# EAGLE schematic D21_v39 (EAGLE 7.3.0)

## Sheet 1 of 4
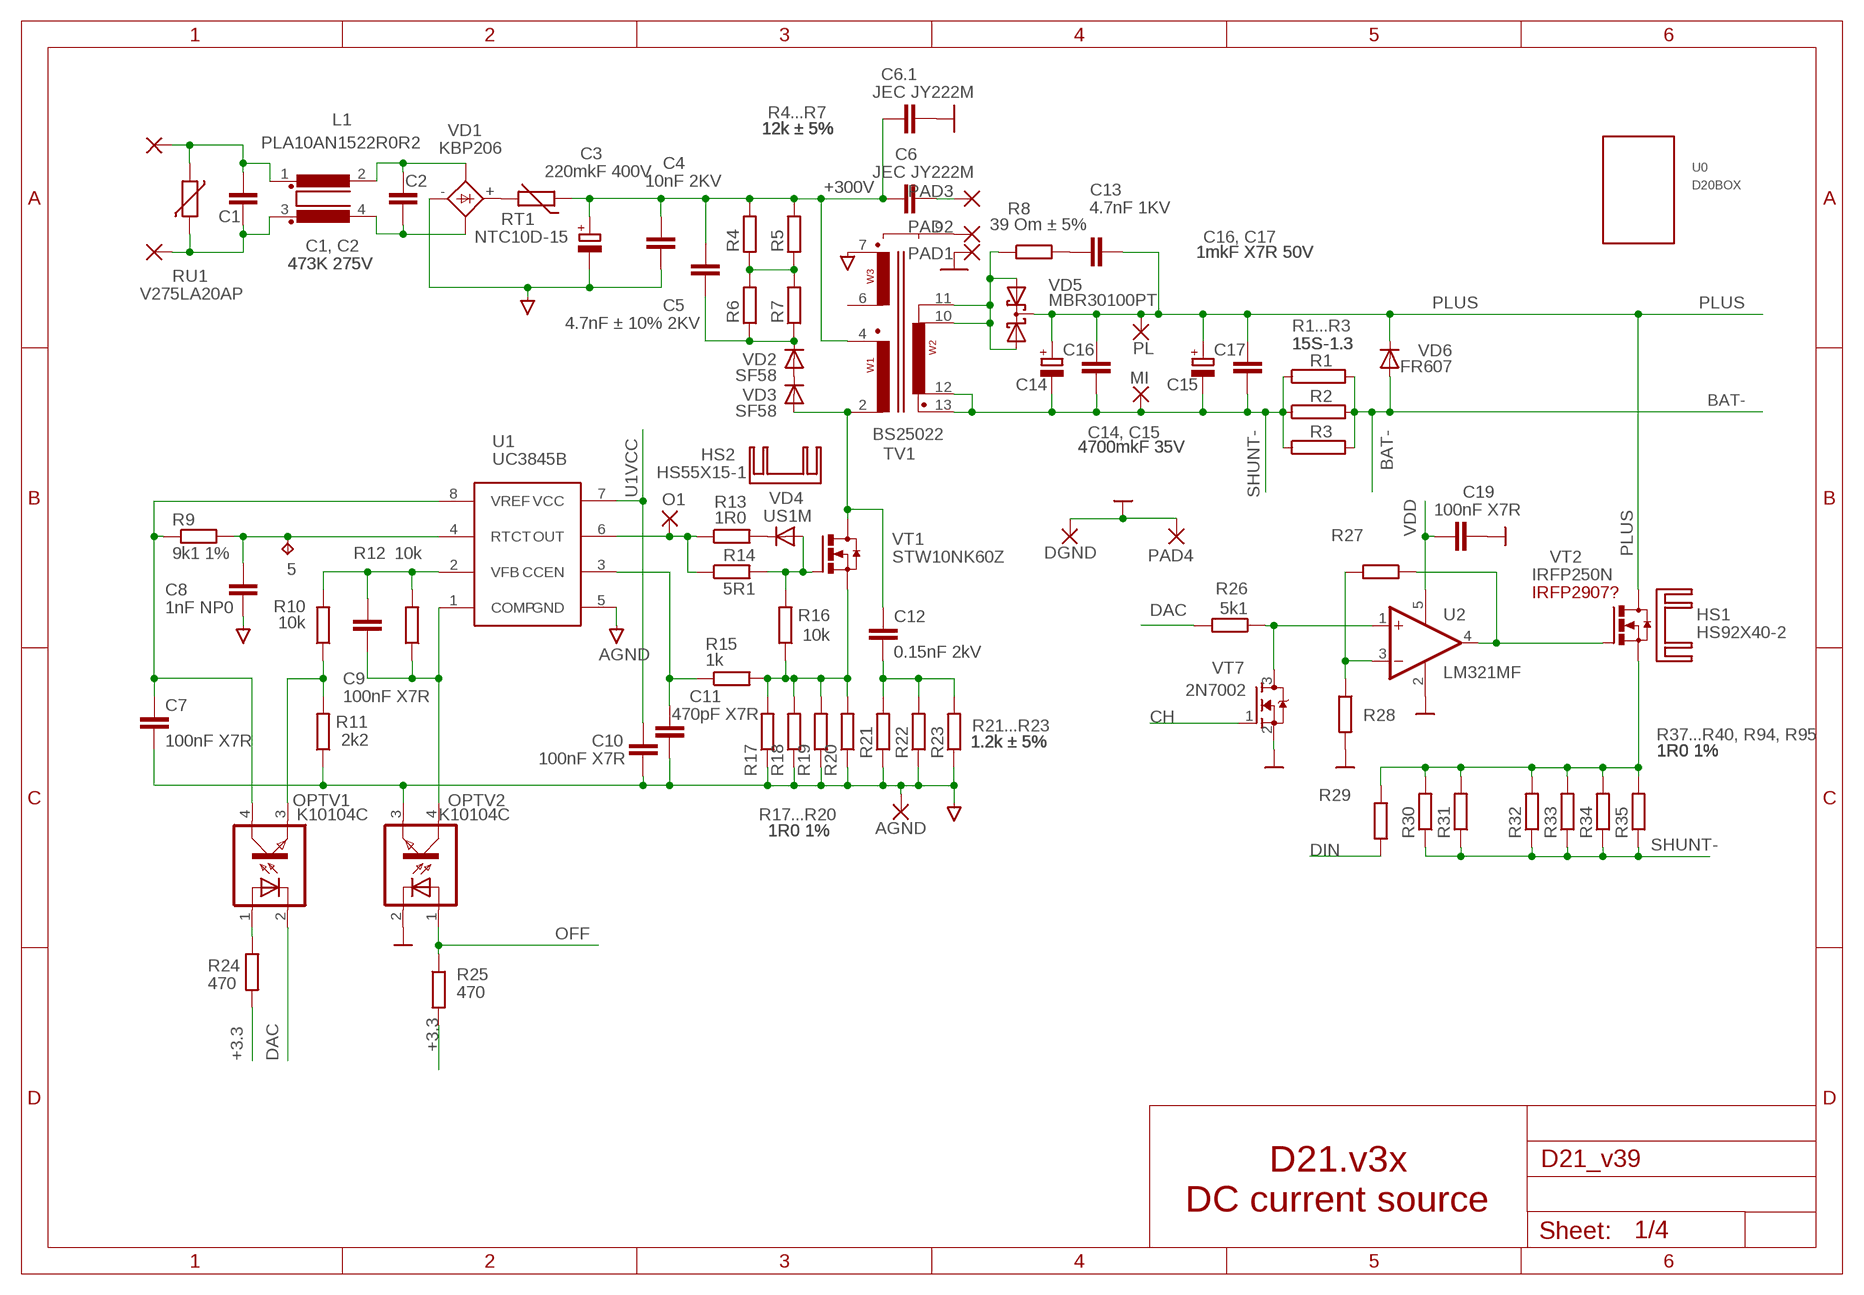
[diagram p0: schematic, sheet 1]

### Parts
5  TPB1,27  [B1,27]
AGND  WIREPAD4,16O1,6  [4,16O1,6]
C1  473K 275V  C-EU150-054X183  [C150-054X183]
C2  473K 275V  C-EU150-054X183  [C150-054X183]
C3  220mkF 400V  CPOL-EUE10-25  [EB25D]
C4  10nF 2KV  C-EU102-043X133  [C102-043X133]
C5  4.7nF ± 10% 2KV  C-EU102-064X133  [C102-064X133]
C6  JEC JY222M  C-EU102-064X133  [C102-064X133]
C6.1  JEC JY222M  C-EU102-064X133  [C102-064X133]
C7  100nF X7R  C-EUC0603  [C0603]
C8  1nF NP0  C-EUC0603  [C0603]
C9  100nF X7R  C-EUC0603  [C0603]
C10  100nF X7R  C-EUC0805  [C0805]
C11  470pF X7R  C-EUC0603  [C0603]
C12  0.15nF 2kV  C-EU075-032X103  [C075-032X103]
C13  4.7nF 1KV  C-EU102-064X133  [C102-064X133]
C14  4700mkF 35V  CPOL-EUE7.5-18  [E7,5-18]
C15  4700mkF 35V  CPOL-EUE7.5-18  [E7,5-18]
C16  1mkF X7R 50V  C-EUC0805  [C0805]
C17  1mkF X7R 50V  C-EUC0805  [C0805]
C19  100nF X7R  C-EUC0603  [C0603]
DGND  WIREPAD4,16O1,6  [4,16O1,6]
HS1  HS92X40-2  [YS92X40]
HS2  HS55X15-1  [HS55X15]
L1  PLA10AN1522R0R2  DK_Q921  [DK30]
MI  WIREPAD4,16O1,6  [4,16O1,6]
O1  WIREPAD1,6/0,8  [1,6/0,8]
OPTV1  K10104C  SFH618A-3X007  [SMD4-7]
OPTV2  K10104C  SFH618A-3X007  [SMD4-7]
PAD1  SMD2  [SMD1,27-2,54]
PAD2  SMD2  [SMD1,27-2,54]
PAD3  SMD2  [SMD1,27-2,54]
PAD4  WIREPAD4,16O1,6  [4,16O1,6]
PL  WIREPAD4,16O1,6  [4,16O1,6]
R1  15S-1.3  [15S-1.3]
R2  15S-1.3  [15S-1.3]
R3  15S-1.3  [15S-1.3]
R4  12k ± 5%  R-0515/20  [0515/20]
R5  12k ± 5%  R-0515/20  [0515/20]
R6  12k ± 5%  R-0515/20  [0515/20]
R7  12k ± 5%  R-0515/20  [0515/20]
R8  39 Om ± 5%  R-0515/20  [0515/20]
R9  9k1 1%  R-EU_R0603  [R0603]
R10  10k  R-EU_R0603  [R0603]
R11  2k2  R-EU_R0603  [R0603]
R12  10k  R-EU_R0603  [R0603]
R13  1R0  R-EU_R0805  [R0805]
R14  5R1  R-EU_R0805  [R0805]
R15  1k  R-EU_R0603  [R0603]
R16  10k  R-EU_R0603  [R0603]
R17  1R0 1%  R-EU_R2512  [R2512]
R18  1R0 1%  R-EU_R2512  [R2512]
R19  1R0 1%  R-EU_R2512  [R2512]
R20  1R0 1%  R-EU_R2512  [R2512]
R21  1.2k ± 5%  R-0515/20  [0515/20]
R22  1.2k ± 5%  R-0515/20  [0515/20]
R23  1.2k ± 5%  R-0515/20  [0515/20]
R24  470  R-EU_R0603  [R0603]
R25  470  R-EU_R0603  [R0603]
R26  5k1  R-EU_R0603  [R0603]
R27  R-EU_R0603  [R0603]
R28  R-EU_R0603  [R0603]
R29  R-EU_R0603  [R0603]
R30  1R0 1%  R-EU_R2512  [R2512]
R31  1R0 1%  R-EU_R2512  [R2512]
R32  1R0 1%  R-EU_R2512  [R2512]
R33  1R0 1%  R-EU_R2512  [R2512]
R34  1R0 1%  R-EU_R2512  [R2512]
R35  1R0 1%  R-EU_R2512  [R2512]
RT1  NTC10D-15  THERMISTOR  [NTC15]
RU1  V275LA20AP  VARISTOR-H  [S10K11-H]
TV1  BS25022  [BS25022]
U0  D20BOX  [D20BOX]
U1  UC3845B  [SO08]
U2  LM321MF  [SOT23-5]
VD1  KBP206  2KBP  [2KBP]
VD2  SF58  1N5624  [DO201-15]
VD3  SF58  1N5624  [DO201-15]
VD4  US1M  DIODESMA  [SMADIODE]
VD5  MBR30100PT  [TO-247AD-V]
VD6  FR607  DIODE-P6-15  [P6-15]
VT1  STW10NK60Z  [TO-247AD-V]
VT2  IRFP250N  IRFP25X  [TO-247AD-V]
VT7  2N7002  MOSFET-NREFLOW  [SOT23-R]
X1  220VAC  [220VAC]

### Nets
10-11: R8.1 TV1.10 TV1.11 VD5.G(A1) VD5.S(A2)
+3.3: R24.2 R25.2 ; also sheet 2,3,4
+300V: C3.+ C4.1 C5.1 C6.1 C6.1.1 R4.2 R5.2 RT1.1 TV1.4 ; also sheet 2
AGND: AGND.1(P) C3.- C4.2 C7.2 C8.2 C10.2 C11.2 OPTV2.3(EMIT) R11.1 R17.1 R18.1 R19.1 R20.1 R21.1 R22.1 R23.1 TV1.7 U1.5(GND) VD1.- ; also sheet 2
BAT-: R1.2 R2.2 R3.2 VD6.A ; also sheet 3,4
CH: VT7.1(G) ; also sheet 4
DAC: OPTV1.2(C) R26.2 ; also sheet 4
DIN: R29.2 ; also sheet 4
DIN1: R29.1 R30.2 R31.2 R32.2 R33.2 R34.2 R35.2 VT2.S
GND: C6.1.2 C19.1 DGND.1(P) OPTV2.2(C) PAD1.1(P) PAD4.1(P) R28.2 U2.2(V-) VT7.2(S) ; supply symbol labelled  ; also sheet 2,3,4
HS2: C5.2 R6.1 R7.1 VD2.C
N$3: R4.1 R5.1 R6.2 R7.2
N$4: VD2.A VD3.C
N$5: C12.1 TV1.2 VD3.A VT1.D
N$6: C12.2 R21.2 R22.2 R23.2
N$7: C1.2 L1.3 RU1.2 X1.P$2
N$8: RT1.2 VD1.+
N$10: R14.2 R16.2 VD4.A VT1.G
N$11: PAD2.1(P) TV1.9
N$12: R15.2 R16.1 R17.2 R18.2 R19.2 R20.2 VT1.S
N$13: C2.1 L1.2 VD1.AC1
N$14: C1.1 L1.1 RU1.1 X1.P$1
N$15: C2.2 L1.4 VD1.AC2
N$17: O1.1(P) R13.1 R14.1 U1.6(OUT)
N$18: R13.2 VD4.C
N$25: OPTV1.1(A) R24.1
N$27: C11.1 R15.1 U1.3(CCEN)
N$30: C9.2 OPTV2.4(COL) R12.1 U1.1(COMP)
N$31: C9.1 R10.2 R12.2 U1.2(VFB)
N$32: OPTV1.3(EMIT) R10.1 R11.2
N$33: C7.1 OPTV1.4(COL) R9.1 U1.8(VREF)
N$34: 5.TP C8.1 R9.2 U1.4(RTCT)
N$35: R27.1 U2.4(OUT) VT2.G
N$38: R27.2 R28.1 U2.3(-IN)
N$41: R26.1 U2.1(+IN) VT7.3(D)
N$42: C6.2 PAD3.1(P)
N$49: C13.1 R8.2
OFF: OPTV2.1(A) R25.1 ; also sheet 4
PLUS: C13.2 C14.+ C15.+ C16.1 C17.1 PL.1(P) VD5.D(C) VD6.C VT2.D ; also sheet 3
SHUNT-: C14.- C15.- C16.2 C17.2 MI.1(P) R1.1 R2.1 R3.1 R30.1 R31.1 R32.1 R33.1 R34.1 R35.1 TV1.12 TV1.13 ; also sheet 4
U1VCC: C10.1 U1.7(VCC) ; also sheet 2
VDD: C19.2 U2.5(V+) ; also sheet 2
Unconnected: TV1.6

### Notes on the sheet
- R4...R7
- C16, C17
- C1, C2
- R1...R3
- C14, C15
- IRFP2907?
- R21...R23
- R37...R40, R94, R95
- R17...R20
- D21.v3x
  DC current source

## Sheet 2 of 4
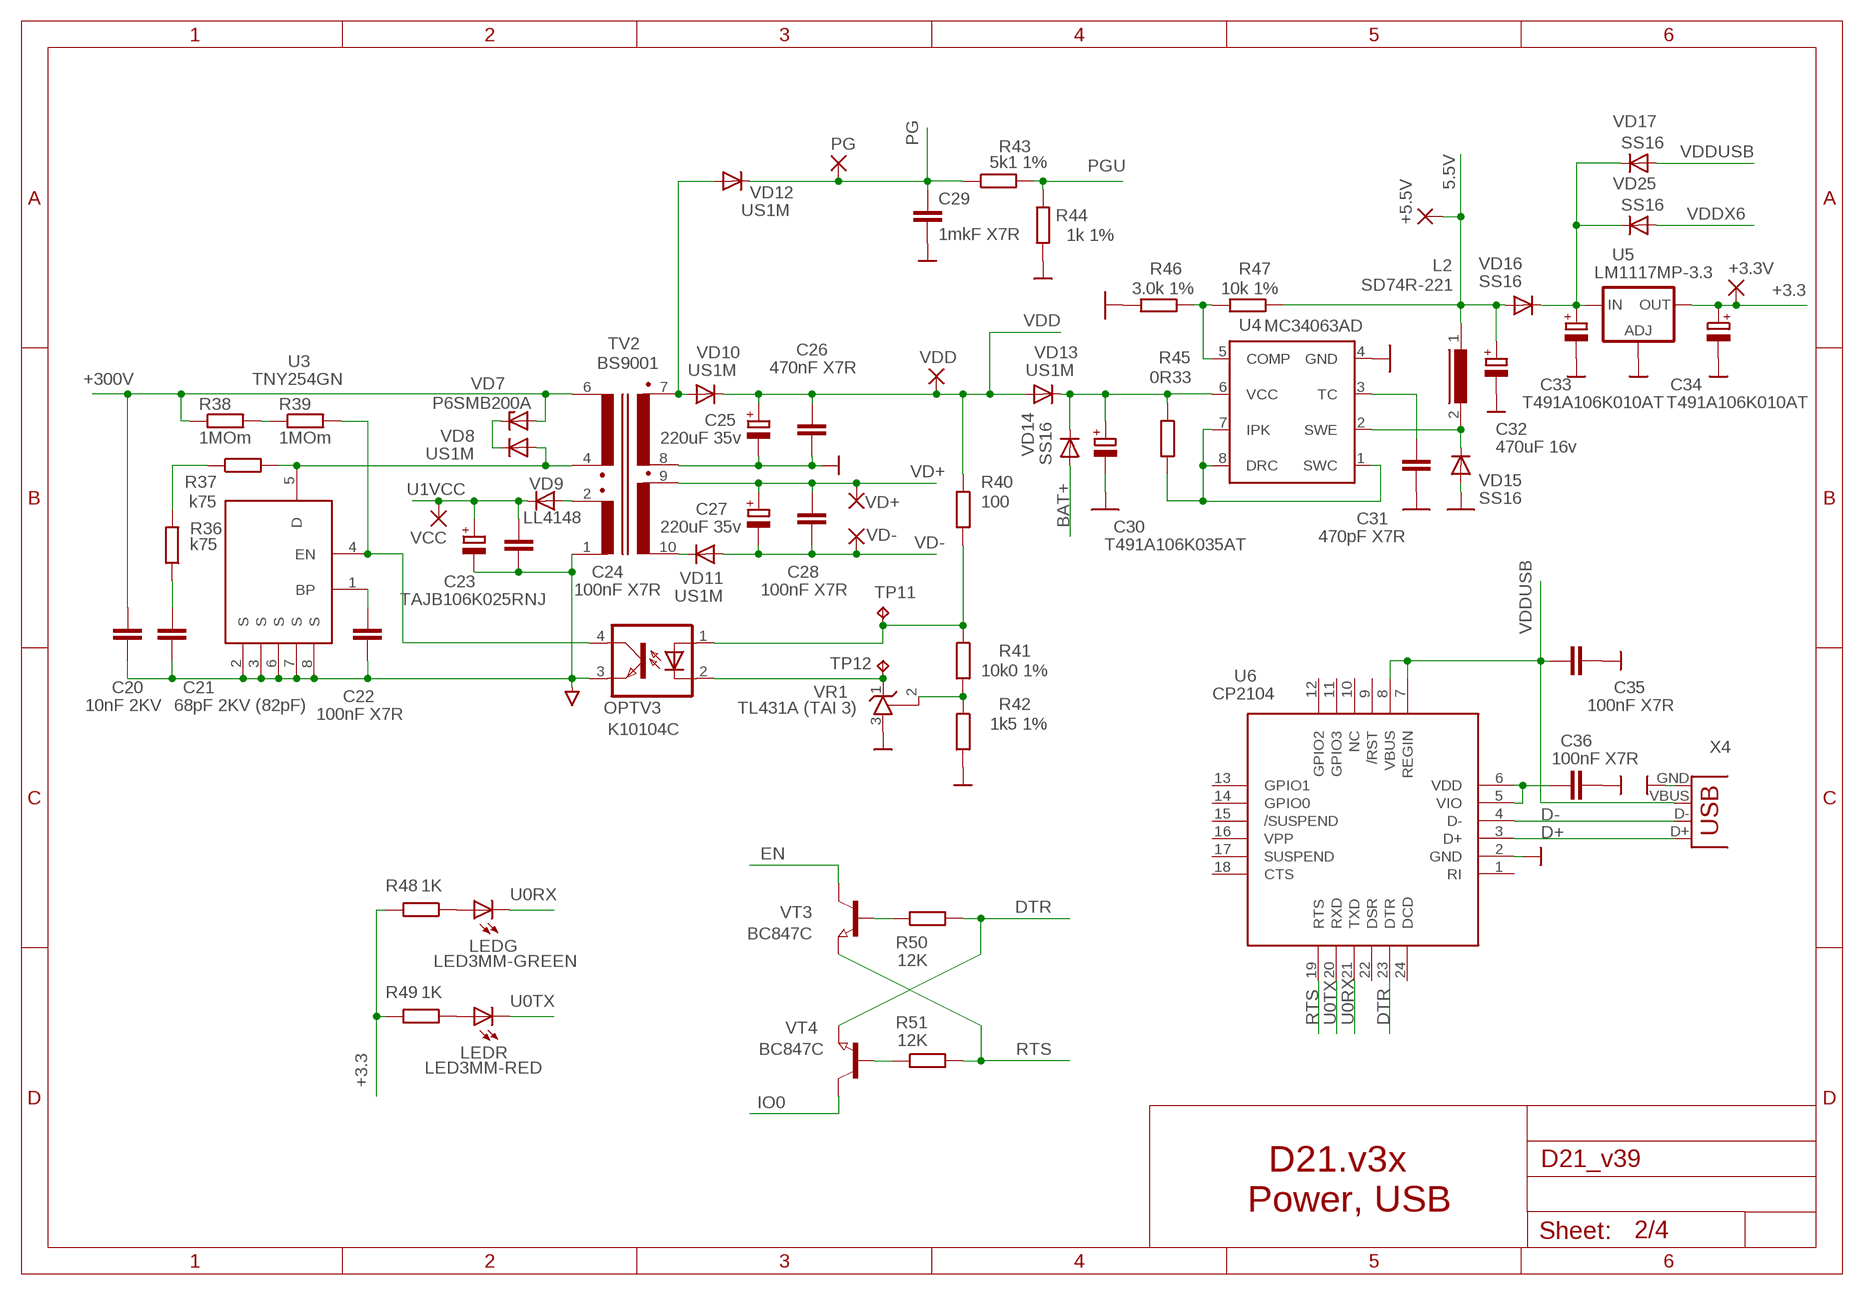
[diagram p1: schematic, sheet 2]

### Parts
+3.3V  WIREPAD1,6/0,8  [1,6/0,8]
+5.5V  WIREPAD1,6/0,8  [1,6/0,8]
C20  10nF 2KV  C-EU102-043X133  [C102-043X133]
C21  68pF 2KV (82pF)  C-EU050-024X044  [C050-024X044]
C22  100nF X7R  C-EUC0603  [C0603]
C23  TAJB106K025RNJ  CPOL-EUCT6032  [CT6032]
C24  100nF X7R  C-EUC0603  [C0603]
C25  220uF 35v  CPOL-EUE3.5-8  [E3,5-8]
C26  470nF X7R  C-EUC0805  [C0805]
C27  220uF 35v  CPOL-EUE3.5-8  [E3,5-8]
C28  100nF X7R  C-EUC0805  [C0805]
C29  1mkF X7R  C-EUC0805  [C0805]
C30  T491A106K035AT  CPOL-EUCT6032  [CT6032]
C31  470pF X7R  C-EUC0603  [C0603]
C32  470uF 16v  CPOL-EUE5-8.5  [E5-8,5]
C33  T491A106K010AT  CPOL-EUCT3216  [CT3216]
C34  T491A106K010AT  CPOL-EUCT3216  [CT3216]
C35  100nF X7R  C-EUC0603  [C0603]
C36  100nF X7R  C-EUC0603  [C0603]
L2  SD74R-221  DR74  [DR74]
LEDG  LED3MM-GREEN  LED3MM-H7MMG  [LED3MM-H7MMG]
LEDR  LED3MM-RED  LED3MM-H7MMR  [LED3MM-H7MMR]
OPTV3  K10104C  SFH618A-3X007  [SMD4-7]
PG  WIREPAD1,6/0,8  [1,6/0,8]
R36  k75  R-EU_R1206  [R1206]
R37  k75  R-EU_R1206  [R1206]
R38  1MOm  R-EU_R1206  [R1206]
R39  1MOm  R-EU_R1206  [R1206]
R40  100  R-EU_R0603  [R0603]
R41  10k0 1%  R-EU_R0603  [R0603]
R42  1k5 1%  R-EU_R0603  [R0603]
R43  5k1 1%  R-EU_R0603  [R0603]
R44  1k 1%  R-EU_R0603  [R0603]
R45  0R33  R-EU_R0603  [R0603]
R46  3.0k 1%  R-EU_R0603  [R0603]
R47  10k 1%  R-EU_R0603  [R0603]
R48  1K  R-EU_R0603  [R0603]
R49  1K  R-EU_R0603  [R0603]
R50  12K  R-EU_R0603  [R0603]
R51  12K  R-EU_R0603  [R0603]
TP11  TPB1,27  [B1,27]
TP12  TPB1,27  [B1,27]
TV2  BS9001  [BS9001]
U3  TNY254GN  [SMD-8]
U4  MC34063AD  [SO08]
U5  LM1117MP-3.3  LM1117SOT223-WAVE  [SOT223-W]
U6  CP2104  [QFN-24]
VCC  WIREPAD1,6/0,8  [1,6/0,8]
VD7  P6SMB200A  ZENER-DIODESMB  [SMB]
VD8  US1M  DIODESMA  [SMADIODE]
VD9  LL4148  DIODE-SOD80C  [SOD80C]
VD10  US1M  DIODESMA  [SMADIODE]
VD11  US1M  DIODESMA  [SMADIODE]
VD12  US1M  DIODESMA  [SMADIODE]
VD13  US1M  DIODESMA  [SMADIODE]
VD14  SS16  DIODESMA  [SMADIODE]
VD15  SS16  DIODESMA  [SMADIODE]
VD16  SS16  DIODESMA  [SMADIODE]
VD17  SS16  DIODESMA  [SMADIODE]
VD25  SS16  DIODESMA  [SMADIODE]
VD+  WIREPAD1,6/0,8  [1,6/0,8]
VD-  WIREPAD1,6/0,8  [1,6/0,8]
VDD  WIREPAD1,6/0,8  [1,6/0,8]
VR1  TL431A (TAI 3)  TL431-SOT23-3  [SOT23]
VT3  BC847C  NPN-TRANSISTOR_SOT23  [SOT23]
VT4  BC847C  NPN-TRANSISTOR_SOT23  [SOT23]
X4  USB-B  USB-B-H  [USB-B-H]

### Nets
5.5V: +5.5V.1(P) C32.+ L2.1 R47.2 VD16.A ; also sheet 3
+3.3: +3.3V.1(P) C34.+ R48.2 R49.2 U5.2(OUT) ; also sheet 1,3,4
+300V: C20.1 R38.1 TV2.6 VD7.A ; also sheet 1
AGND: C20.2 C21.2 C22.2 C23.- C24.2 OPTV3.3(EMIT) TV2.1 U3.2(S) U3.3(S) U3.6(S) U3.7(S) U3.8(S) ; also sheet 1
BAT+: VD14.A ; also sheet 3,4
D+: U6.3(D+) X4.D+
D-: U6.4(D-) X4.D-
DTR: R50.2 U6.23(DTR) VT4.2(E)
EN: VT3.3(C) ; also sheet 3
GND: C25.- C26.2 C29.2 C30.- C31.2 C32.- C33.- C34.- C35.2 C36.2 R42.2 R44.1 R46.1 TV2.8 U4.4(GND) U5.1(ADJ) U6.2(GND) VD15.A VR1.3(A) X4.GND ; supply symbol labelled  ; also sheet 1,3,4
IO0: VT4.3(C) ; also sheet 3
N$1: R36.2 R37.1
N$2: C36.1 U6.5(VIO) U6.6(VDD)
N$16: R37.2 TV2.4 U3.5(D) VD8.A
N$19: C21.1 R36.1
N$20: C22.1 U3.1(BP)
N$21: R38.2 R39.1
N$22: OPTV3.4(COL) R39.2 U3.4(EN)
N$23: OPTV3.1(A) R40.2 R41.1 TP11.TP
N$24: TV2.2 VD9.A
N$26: VD7.C VD8.C
N$45: TV2.10 VD11.C
N$46: TV2.7 VD10.A VD12.A
N$50: C30.+ R45.1 U4.6(VCC) VD13.C VD14.C
N$51: LEDR.A R49.1
N$52: LEDG.A R48.1
N$64: R45.2 U4.1(SWC) U4.7(IPK) U4.8(DRC)
N$65: L2.2 U4.2(SWE) VD15.C
N$66: C31.1 U4.3(TC)
N$67: R46.2 R47.1 U4.5(COMP)
N$69: C33.+ U5.3(IN) VD16.C VD17.C VD25.C
N$70: R41.2 R42.1 VR1.2(R)
N$71: R51.1 VT4.1(B)
N$72: R50.1 VT3.1(B)
N$73: OPTV3.2(C) TP12.TP VR1.1(C)
PG: C29.1 PG.1(P) R43.1 VD12.C ; also sheet 3
PGU: R43.2 R44.2 ; also sheet 3
RTS: R51.2 U6.19(RTS) VT3.2(E)
U0RX: LEDG.K(C) U6.21(TXD) ; also sheet 3
U0TX: LEDR.K(C) U6.20(RXD) ; also sheet 3
U1VCC: C23.+ C24.1 VCC.1(P) VD9.C ; also sheet 1
VD+: C27.+ C28.1 TV2.9 VD+.1(P) ; also sheet 3
VD-: C27.- C28.2 VD11.A VD-.1(P) ; also sheet 3
VDD: C25.+ C26.1 R40.1 VD10.C VD13.A VDD.1(P) ; also sheet 1
VDDUSB: C35.1 U6.7(REGIN) U6.8(VBUS) VD17.A X4.VBUS
VDDX6: VD25.A ; also sheet 4
Unconnected: U6.1(RI) U6.9(/RST) U6.10(NC) U6.11(GPIO3) U6.12(GPIO2) U6.13(GPIO1) U6.14(GPIO0) U6.15(/SUSPEND) U6.16(VPP) U6.17(SUSPEND) U6.18(CTS) U6.22(DSR) U6.24(DCD)

### Notes on the sheet
- D21.v3x
  Power, USB

## Sheet 3 of 4
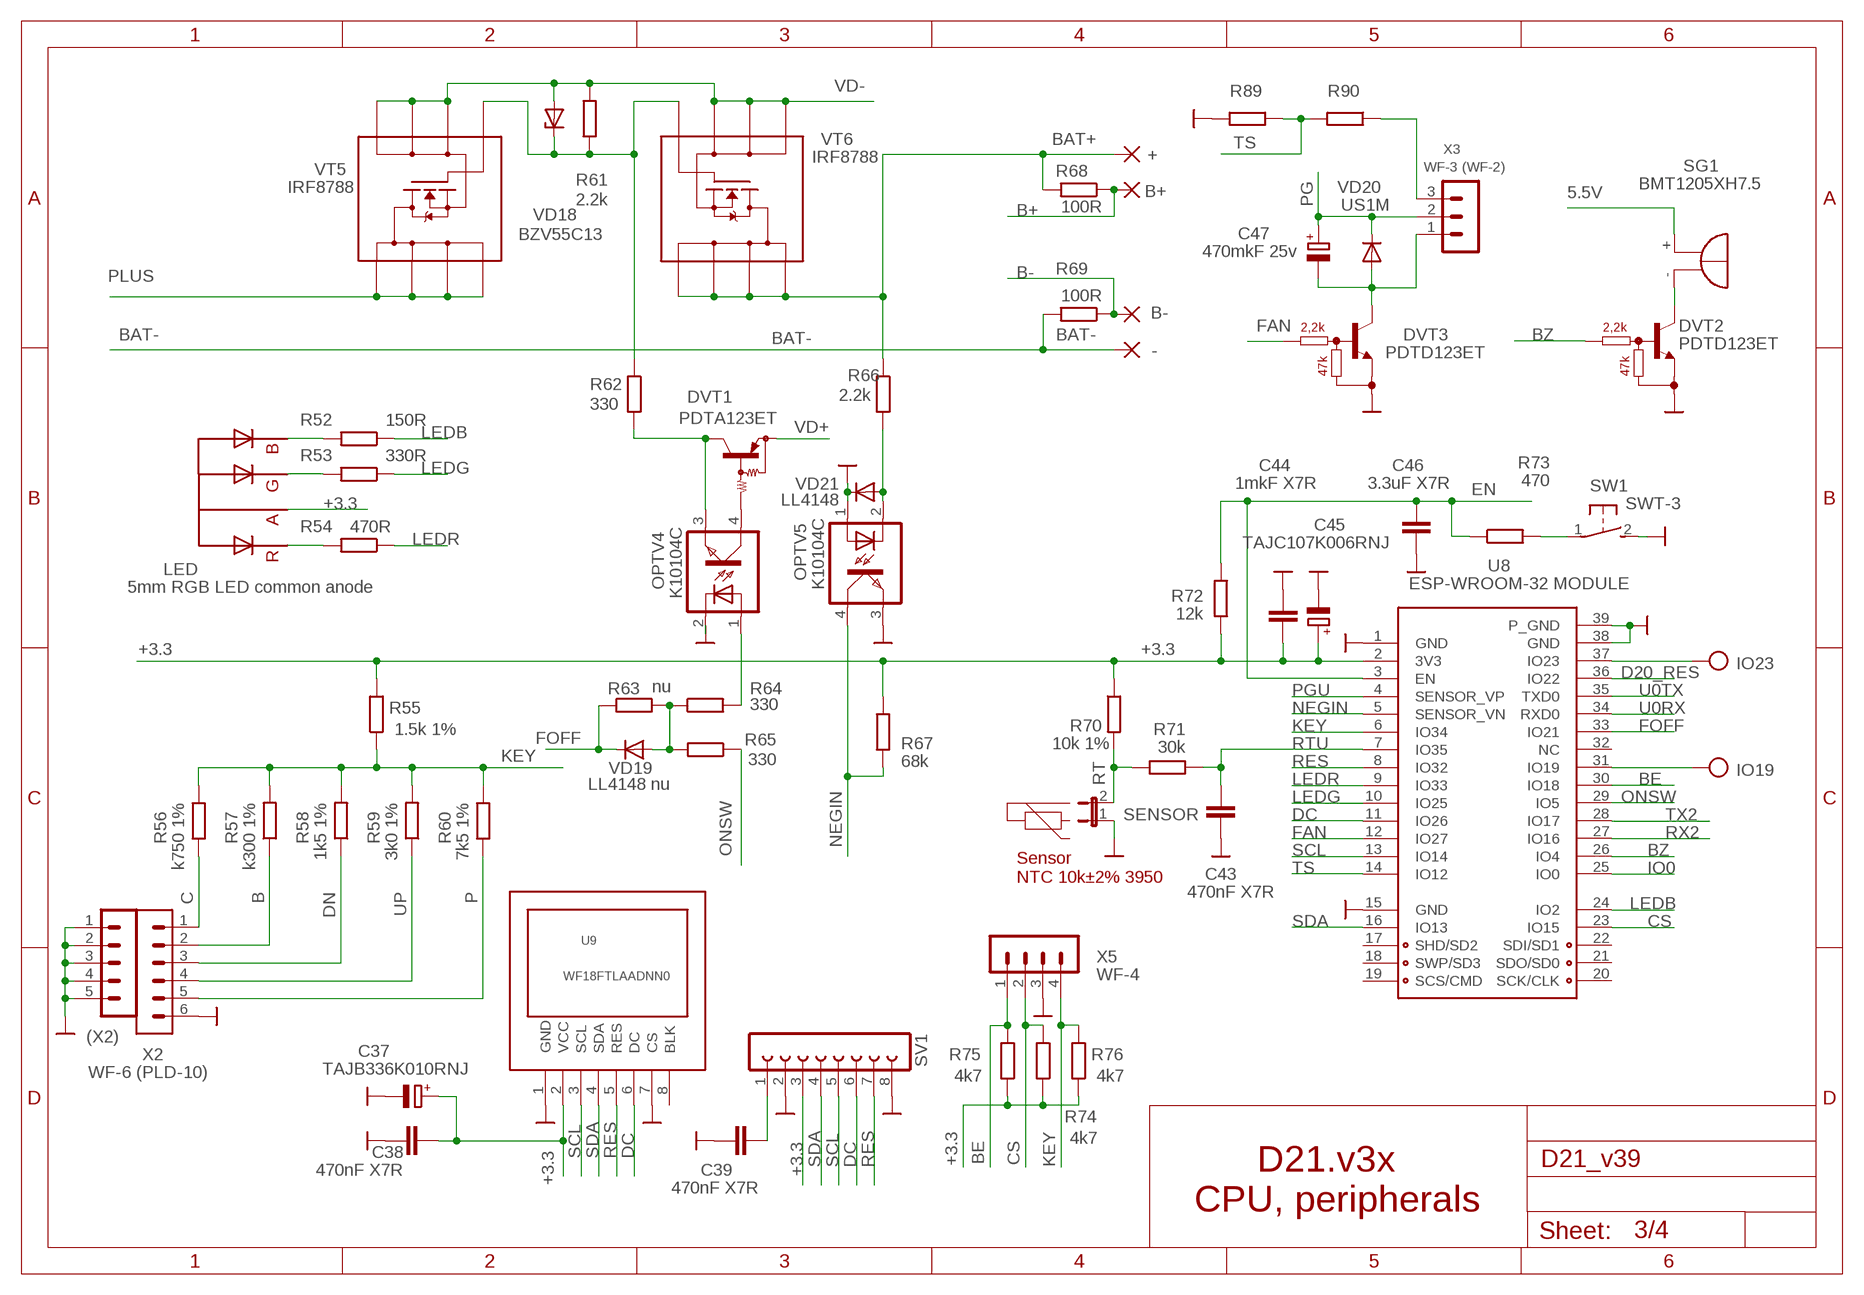
[diagram p2: schematic, sheet 3]

### Parts
(X2)  MA05-1  [MA05-1]
+  +  WIREPAD8_3  [WIREPAD8_3]
-  -  WIREPAD8_3  [WIREPAD8_3]
B+  WIREPAD4,16O1,6  [4,16O1,6]
B-  WIREPAD4,16O1,6  [4,16O1,6]
C37  TAJB336K010RNJ  CPOL-EUCT6032  [CT6032]
C38  470nF X7R  C-EUC0805  [C0805]
C39  470nF X7R  C-EUC0805  [C0805]
C43  470nF X7R  C-EUC0805  [C0805]
C44  1mkF X7R  C-EUC0805  [C0805]
C45  TAJC107K006RNJ  CPOL-EUCT3528  [CT3528]
C46  3.3uF X7R  C-EUC0603  [C0603]
C47  470mkF 25v  CPOL-EUE3.5-8  [E3,5-8]
DVT1  PDTA123ET  MUN2113T1  [SC59-BEC]
DVT2  PDTD123ET  BCR108  [SOT23-BEC]
DVT3  PDTD123ET  BCR108  [SOT23-BEC]
IO19  TESTPOINTROUND1MM  [TESTPOINT_ROUND_1MM]
IO23  TESTPOINTROUND1MM  [TESTPOINT_ROUND_1MM]
LED  5mm RGB LED common anode  5MMRGBLED  [LED5MMRGB]
OPTV4  K10104C  SFH618A-3X007  [SMD4-7]
OPTV5  K10104C  SFH618A-3X007  [SMD4-7]
R52  150R  R-EU_R0603  [R0603]
R53  330R  R-EU_R0603  [R0603]
R54  470R  R-EU_R0603  [R0603]
R55  1.5k 1%  R-EU_R0603  [R0603]
R56  k750 1%  R-EU_R0603  [R0603]
R57  k300 1%  R-EU_R0603  [R0603]
R58  1k5 1%  R-EU_R0603  [R0603]
R59  3k0 1%  R-EU_R0603  [R0603]
R60  7k5 1%  R-EU_R0603  [R0603]
R61  2.2k  R-EU_R0603  [R0603]
R62  330  R-EU_R0603  [R0603]
R63  nu  R-EU_R0603  [R0603]
R64  330  R-EU_R0603  [R0603]
R65  330  R-EU_R0603  [R0603]
R66  2.2k  R-EU_R0603  [R0603]
R67  68k  R-EU_R0603  [R0603]
R68  100R  R-EU_R0603  [R0603]
R69  100R  R-EU_R0603  [R0603]
R70  10k 1%  R-EU_R0603  [R0603]
R71  30k  R-EU_R0603  [R0603]
R72  12k  R-EU_R0603  [R0603]
R73  470  R-EU_R0603  [R0603]
R74  4k7  R-EU_R0603  [R0603]
R75  4k7  R-EU_R0603  [R0603]
R76  4k7  R-EU_R0603  [R0603]
R89  R-EU_R0603  [R0603]
R90  R-EU_R0603  [R0603]
SENSOR  JP1E  [JP1]
SG1  BMT1205XH7.5  [BMT1205XH7.5]
SV1  FE08-1  [FE08]
SW1  SWT-3  31-XX  [B3F-31XX]
U8  ESP-WROOM-32 MODULE  ESP-WROOM-32  [ESP-WROOM-32MORO]
U9  WF18FTLAADNN0  TFT_128_128  [TFT_1_8]
VD18  BZV55C13  ZENER-DIODESOD80C  [SOD80C]
VD19  LL4148 nu  DIODE-SOD80C  [SOD80C]
VD20  US1M  DIODESMA  [SMADIODE]
VD21  LL4148  DIODE-SOD80C  [SOD80C]
VT5  IRF8788  [SO-8]
VT6  IRF8788  [SO-8]
X2  WF-6 (PLD-10)  WF-6  [WF-6]
X3  WF-3 (WF-2)  WF-3  [WF-3]
X5  WF-4  [WF-4]

### Nets
5.5V: SG1.+ ; also sheet 2
+3.3: C37.+ C38.1 C44.1 C45.+ LED.P$3(A) R55.2 R67.1 R70.1 R72.1 R74.1 R75.1 R76.1 SV1.3 U8.2(3V3) U9.2(VCC) ; also sheet 1,2,4
B: R57.1 X2.2
B+: B+.1(P) R68.1 ; also sheet 4
B-: B-.1(P) R69.1 ; also sheet 4
BAT+: +.P$1(P) R66.1 R68.2 VT6.5(D) VT6.6(D) VT6.7(D) VT6.8(D) ; also sheet 2,4
BAT-: -.P$1(P) R69.2 ; also sheet 1,4
BE: R75.2 U8.30(IO18) X5.1
BZ: DVT2.B U8.26(IO4)
C: R56.2 X2.1
CS: R74.2 U8.23(IO15) X5.2
D20_RES: U8.36(IO22) ; also sheet 4
DC: SV1.6 U8.11(IO26) U9.6(DC)
DN: R58.1 X2.3
EN: C46.2 R72.2 R73.1 U8.3(EN) ; also sheet 2
FAN: DVT3.B U8.12(IO27)
FOFF: R63.1 U8.33(IO21) VD19.C ; also sheet 4
G: R61.1 R62.1 VD18.C VT5.4(G) VT6.4(G)
GND: (X2).1 (X2).2 (X2).3 (X2).4 (X2).5 C37.- C38.2 C39.2 C43.2 C44.2 C45.- C46.1 DVT2.E DVT3.E OPTV4.2(C) OPTV5.1(A) OPTV5.3(EMIT) R89.2 SENSOR.1 SV1.2 SV1.8 SW1.2(S) U8.1(GND) U8.15(GND) U8.38(GND) U8.39(P_GND) U9.1(GND) U9.7(CS) VD21.C X2.6 X5.3 ; supply symbol labelled  ; also sheet 1,2,4
IO0: U8.25(IO0) ; also sheet 2
KEY: R55.1 R56.1 R57.2 R58.2 R59.2 R60.1 R76.2 U8.6(IO34) X5.4
LEDB: R52.1 U8.24(IO2)
LEDG: R53.1 U8.10(IO25)
LEDR: R54.1 U8.9(IO33)
N$9: R90.1 X3.3
N$28: C39.1 SV1.1
N$37: DVT2.C SG1.-
N$39: LED.P$2(GREEN) R53.2
N$40: LED.P$1(BLUE) R52.2
N$44: LED.P$4(RED) R54.2
N$48: C47.- DVT3.C VD20.A X3.1
N$53: DVT1.C OPTV4.3(EMIT) R62.2
N$54: DVT1.B OPTV4.4(COL)
N$55: OPTV5.2(C) R66.2 VD21.A
N$56: R63.2 R64.1 R65.2 VD19.A
N$61: IO23.P$1 U8.37(IO23)
N$62: IO19.P$1 U8.31(IO19)
N$63: R73.2 SW1.1(P)
NEGIN: OPTV5.4(COL) R67.2 U8.5(SENSOR_VN)
ONSW: R65.1 U8.29(IO5)
P: R60.2 X2.5
PG: C47.+ VD20.C X3.2 ; also sheet 2
PGU: U8.4(SENSOR_VP) ; also sheet 2
PLUS: VT5.5(D) VT5.6(D) VT5.7(D) VT5.8(D) ; also sheet 1
RES: SV1.7 U8.8(IO32) U9.5(RES)
RT: R70.2 R71.1 SENSOR.2
RTU: C43.1 R71.2 U8.7(IO35) ; also sheet 4
RX2: U8.27(IO16) ; also sheet 4
SCL: SV1.5 U8.13(IO14) U9.3(SCL)
SDA: SV1.4 U8.16(IO13) U9.4(SDA)
TOV2: OPTV4.1(A) R64.2
TS: R89.1 R90.2 U8.14(IO12)
TX2: U8.28(IO17) ; also sheet 4
U0RX: U8.34(RXD0) ; also sheet 2
U0TX: U8.35(TXD0) ; also sheet 2
UP: R59.1 X2.4
VD+: DVT1.E ; also sheet 2
VD-: R61.2 VD18.A VT5.1(S) VT5.2(S) VT5.3(S) VT6.1(S) VT6.2(S) VT6.3(S) ; also sheet 2
Unconnected: U8.17(SHD/SD2) U8.18(SWP/SD3) U8.19(SCS/CMD) U8.20(SCK/CLK) U8.21(SDO/SD0) U8.22(SDI/SD1) U8.32(NC)

### Notes on the sheet
- Sensor
  NTC 10k±2% 3950
- D21.v3x
  CPU, peripherals

## Sheet 4 of 4
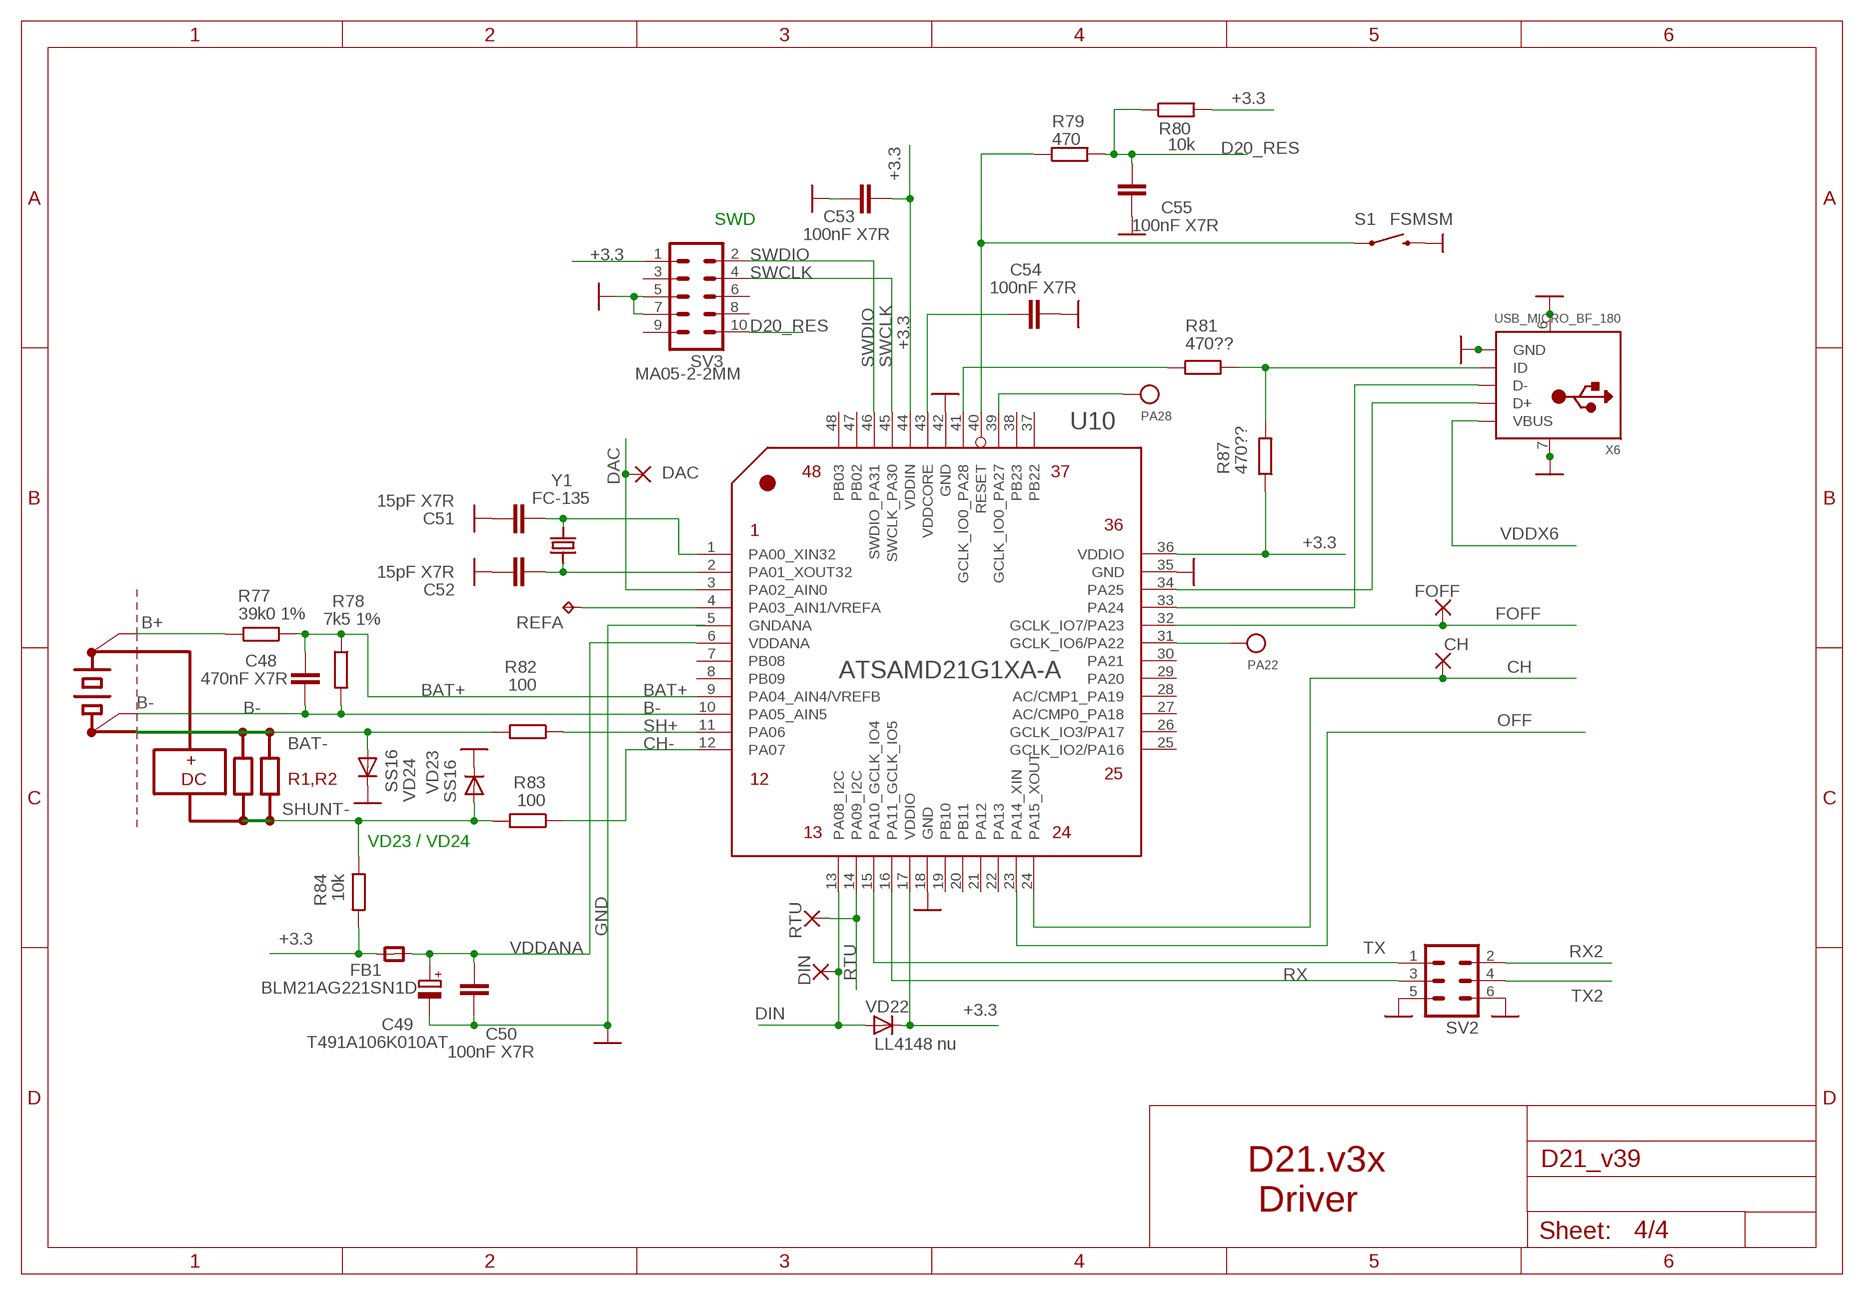
[diagram p3: schematic, sheet 4]

### Parts
C48  470nF X7R  C-EUC0805  [C0805]
C49  T491A106K010AT  CPOL-EUCT3216  [CT3216]
C50  100nF X7R  C-EUC0603  [C0603]
C51  15pF X7R  C-EUC0603  [C0603]
C52  15pF X7R  C-EUC0603  [C0603]
C53  100nF X7R  C-EUC0603  [C0603]
C54  100nF X7R  C-EUC0603  [C0603]
C55  100nF X7R  C-EUC0805  [C0805]
CH  WIREPAD1,6/0,8  [1,6/0,8]
DAC  WIREPAD1,6/0,8  [1,6/0,8]
DIN  WIREPAD1,6/0,8  [1,6/0,8]
FB1  BLM21AG221SN1D  FERRITE0805  [0805]
FOFF  WIREPAD1,6/0,8  [1,6/0,8]
PA22  TESTPOINTROUND1MM  [TESTPOINT_ROUND_1MM]
PA28  TESTPOINTROUND1MM  [TESTPOINT_ROUND_1MM]
R77  39k0 1%  R-EU_R0603  [R0603]
R78  7k5 1%  R-EU_R0603  [R0603]
R79  470  R-EU_R0603  [R0603]
R80  10k  R-EU_R0603  [R0603]
R81  470??  R-EU_R0603  [R0603]
R82  100  R-EU_R0603  [R0603]
R83  100  R-EU_R0603  [R0603]
R84  10k  R-EU_R0603  [R0603]
R87  470??  R-EU_R0603  [R0603]
REFA  TPB1,27  [B1,27]
RTU  WIREPAD1,6/0,8  [1,6/0,8]
S1  FSMSM  SWITCH-MOMENTARY-2-SMD-1101NE  [TACTILE-SWITCH-1101NE]
SV2  MA03-2  [MA03-2]
SV3  MA05-2-2MM  [MA5-2-2MM]
U10  ATSAMD21G1XA-A  [LQFP48_W]
VD22  LL4148 nu  DIODE-SOD80C  [SOD80C]
VD23  SS16  DIODESMA  [SMADIODE]
VD24  SS16  DIODESMA  [SMADIODE]
X6  USB_MICRO_BF_180  [USB_MICRO_180]
Y1  FC-135  [SMD03215C2]

### Nets
+3.3: C53.1 FB1.1 R80.2 R84.2 R87.1 SV3.1 U10.17(VDDIO) U10.36(VDDIO) U10.44(VDDIN) VD22.C ; also sheet 1,2,3
B+: R77.2 ; also sheet 3
B-: C48.2 R78.2 U10.10(PA05_AIN5) ; also sheet 3
BAT+: C48.1 R77.1 R78.1 U10.9(PA04_AIN4/VREFB) ; also sheet 2,3
BAT-: R82.2 VD24.A ; also sheet 1,3
CH: CH.1(P) U10.24(PA15_XOUT) ; also sheet 1
CH-: R83.1 U10.12(PA07)
D20_RES: C55.2 R79.2 R80.1 SV3.10 ; also sheet 3
DAC: DAC.1(P) U10.3(PA02_AIN0) ; also sheet 1
DIN: DIN.1(P) U10.13(PA08_I2C) VD22.A ; also sheet 1
FOFF: FOFF.1(P) U10.32(GCLK_IO7/PA23) ; also sheet 3
GND: C49.- C50.2 C51.2 C52.2 C53.2 C54.1 C55.1 S1.P$2 SV2.5 SV2.6 SV3.5 SV3.7 U10.18(GND) U10.35(GND) U10.42(GND) VD23.C VD24.C X6.5(GND) X6.6 X6.7 ; supply symbol labelled  ; also sheet 1,2,3
N$29: R79.1 S1.P$1 U10.40(RESET)
N$36: C52.1 U10.2(PA01_XOUT32) Y1.P$1
N$43: REFA.TP U10.4(PA03_AIN1/VREFA)
N$47: C51.1 U10.1(PA00_XIN32) Y1.P$2
N$57: U10.33(PA24) X6.2(D-)
N$58: U10.34(PA25) X6.3(D+)
N$59: R81.2 R87.2 X6.4(ID)
N$74: PA28.P$1 U10.39(GCLK_IO0_PA27)
N$75: PA22.P$1 U10.31(GCLK_IO6/PA22)
OFF: U10.23(PA14_XIN) ; also sheet 1
PA28: R81.1 U10.41(GCLK_IO0_PA28)
RTU: RTU.1(P) U10.14(PA09_I2C) ; also sheet 3
RX: SV2.3 U10.16(PA11_GCLK_IO5)
RX2: SV2.2 ; also sheet 3
SH+: R82.1 U10.11(PA06)
SHUNT-: R83.2 R84.1 VD23.A ; also sheet 1
SWCLK: SV3.4 U10.45(SWCLK_PA30)
SWDIO: SV3.2 U10.46(SWDIO_PA31)
TX: SV2.1 U10.15(PA10_GCLK_IO4)
TX2: SV2.4 ; also sheet 3
VDDANA: C49.+ C50.1 FB1.2 U10.6(VDDANA)
VDDCORE: C54.2 U10.43(VDDCORE)
VDDX6: X6.1(VBUS) ; also sheet 2
Unconnected: SV3.3 SV3.6 SV3.8 SV3.9 U10.7(PB08) U10.8(PB09) U10.19(PB10) U10.20(PB11) U10.21(PA12) U10.22(PA13) U10.25(GCLK_IO2/PA16) U10.26(GCLK_IO3/PA17) U10.27(AC/CMP0_PA18) U10.28(AC/CMP1_PA19) U10.29(PA20) U10.30(PA21) U10.37(PB22) U10.38(PB23) U10.47(PB02) U10.48(PB03)

### Notes on the sheet
- SWD
- +
  DC
- R1,R2
- VD23 / VD24
- D21.v3x
   Driver

## Power pins joined to a net without a drawn wire
BLK: U9.8(BLK)
GND: U10.5(GNDANA)

## Library data of the parts
5 REFA TP11 TP12 = testpad:TP: Test pad
(X2) = con-lstb_moro:MA05-1: PIN HEADER; OC_FARNELL: unknown; OC_NEWARK: unknown
+ - = Q921s:WIREPAD8_3
+3.3V +5.5V AGND B+ B- CH DAC DGND DIN FOFF MI O1 PAD4 PG PL RTU VCC VD+ VD- VDD = wirepad:WIREPAD: Wire PAD connect wire on PCB
C1 C2 C4-C6 C6.1 C7-C13 C16 C17 C19-C22 C24 C26 C28 C29 C31 C35 C36 C38 C39 C43 C44 C46 C48 C50-C55 = rcl_moro:C-EU: CAPACITOR, European symbol
C3 C14 C15 C23 C25 C27 C30 C32-C34 C37 C45 C47 C49 = rcl_moro:CPOL-EU: POLARIZED CAPACITOR, European symbol
DVT1 = transistor-pnp:MUN2113*: PNP Bias Resistor Transistor
DVT2 DVT3 = digital-transistors:BCR108: NPN Silicon Digital Transistor 50V 0,1A 0,2W
FB1 = microbuilder_v2:FERRITE: Ferrite Bead 0603 MMZ1608B121C - 120 Ohm @ 100MHz, 600mA, 0.15 Ohm DC Resistance - Digikey: 445-2164-1-ND BK1608HW121-T - 120 Ohm, 600mA Ferrite Chip - Digikey: 587-1876-2-ND 0805 HZ0805B272R-10 - 2.7K Ohm @ 100MHz, 200mA, 0.8 Ohm DC Resistance - Digikey: 240-2504-1-ND (see also Murata BLM21BD272SN1L) MMZ2012Y152B - 1.5K Ohm @ 100MHz, 500mA, 0.4 Ohm DC Resistance - Digikey: 445-1560-1-ND - Mainly for high frequency (80-400MHz) MMZ2012R102A - 1K Ohm @ 100MHz, 500mA, 0.3 Ohm DC Resistance - Digikey: 445-1555-2-ND - More general purpose (10-200MHz)
HS1 = Q921:HS92X40-2
HS2 = Q921:HS55X15-1
IO19 IO23 PA22 PA28 = microbuilder_v2:TESTPOINT: Test Point Various test points for characterisation and PCB testing TESTPOINT_SMT - Compact Surface Mount Test Point [Digikey: 5016KTR-ND]
L1 = Q921:DK_Q921
L2 = inductors:DR74: High Power Density, High Efficiency, Shielded Inductors Source: coiltronics_dr_series.pdf
LED = led_rgb:5MMRGBLED
LEDG = moro4:LED3MM-H7MMG
LEDR = moro4:LED3MM-H7MMR
OPTV1-OPTV5 = optocoupler:SFH618?*: Optocoupler, Phototransistor Output, Low Input Current Source: Data sheet <http://www.vishay.com/docs/83673/sfh618.pdf>; OC_FARNELL: unknown; OC_NEWARK: unknown
PAD1-PAD3 = wirepad:SMD2: SMD PAD
R1-R3 = Q921:15S-1.3
R4-R8 R21-R23 = Q921:R-0515/20
R9-R20 R24-R84 R87 R89 R90 = rcl_moro:R-EU_: RESISTOR, European symbol
RT1 = varistor_moro:THERMISTOR: THERMISTOR
RU1 = varistor_moro:VARISTOR-H
S1 = SparkFun:SWITCH-MOMENTARY-2
SENSOR = jumper_moro:JP1E: JUMPER
SG1 = buzzer-moro:BMT1205XH7.5: MAGNETIC TRANSDUCER Source: Http:www.be-star.com; OC_FARNELL: unknown; OC_NEWARK: unknown
SV1 = con-lsta_moro:FE08-1: FEMALE HEADER; OC_FARNELL: unknown; OC_NEWARK: unknown
SV2 = con-lstb_moro:MA03-2: PIN HEADER; OC_FARNELL: unknown; OC_NEWARK: unknown
SV3 = con-lstb_moro:MA05-2-2MM
SW1 = switch-omron:31-XX: OMRON SWITCH; MPN: B3F-3100; OC_FARNELL: 959704; OC_NEWARK: 36M3582
TV1 = Q921:BS25022
TV2 = Q921:BS9001
U0 = Q921 (2):D20BOX
U1 = moro4:UC3845B
U2 = linear:LM321?*: Low Power Single Op Amp Source: http://cache.national.com/ds/LM/LM321.pdf
U3 = moro4:TNY254GN
U4 = v-reg-3:MC34063A: 1.5A Step-Up/Down/Inverting Switching Regulator NPN Darlington Switch, Vin 3V to 40V, Current Limiter Input, adjustable Frequency up to 100kHz
U5 = microbuilder_v2:LM1117: LM1117 Voltage Regulator LM1117 Adjustable Voltage regulator [Digikey: LM1117IMP-ADJDKR-ND] LM1117 3.3V Voltage regulator [AP1117E33GDIDKR-ND] LM1117 5.0V Voltage regulator [AP1117E50GDIDKR-ND] SOT223-REFLOW - SOT223 package for solder paste/reflow ovens SOT223-WAVE - SOT223 package for hand-soldering (larger pads) Note: For the fixed-voltage regulators, simply set the ADJ pin to GND.
U6 = moro4:CP2104
U8 = esp32:ESP-WROOM-32: Espressif Systems ESP-WROOM-32
U9 = Q921:TFT_128_128
U10 = atmel_prototype_header:ATSAMD21G1XA-A
VD1 = Q921:2KBP
VD2 VD3 = diode-1:1N5624: DIODE controlled avalanche rectifier
VD4 = microbuilder (2):DIODE: Diode
VD5 = Q921 (2):MBR30100PT
VD6 = diode-1:DIODE-: DIODE
VD7 VD18 = diode-1:ZENER-DIODE: Z-Diode
VD8 VD10-VD17 VD20 VD23-VD25 = microbuilder_v2:DIODE: Diode
VD9 VD19 VD21 VD22 = diode:DIODE-: DIODE
VR1 = moro4:TL431-SOT23-3
VT1 = Q921 (2):STW10NK60Z
VT2 = Q921 (2):IRFP25X
VT3 VT4 = semicon-smd-ipc:NPN-TRANSISTOR_: NPN TRANSISTOR
VT5 VT6 = transistor-fet_moro:IRF8788
VT7 = microbuilder (2):MOSFET-N: N-Channel Mosfet 2N7002E - 60V 260mA SOT23 [Digikey: 2N7002ET1GOSTR-ND] BSH103 - 30V 850mA SOT23 [Digikey: 568-5013-1-ND]
X1 = Q921:220VAC
X2 = moro2:WF-6
X3 = moro2:WF-3
X4 = con-usb-3:USB: USB Connectors
X5 = moro2:WF-4
X6 = microbuilder:USB_MICRO_BF_180
Y1 = microbuilder_v2:FC-135